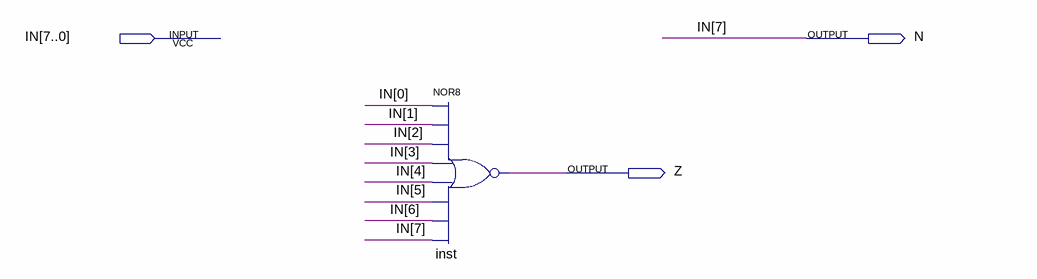
[diagram p0: schematic sheet]
// Quartus schematic flagLogic.bdf as structural Verilog: 1 symbols, 3 pins
module flagLogic (
  input  [7:0] IN,
  output N,
  output Z
);

  nor inst (Z, IN[0], IN[1], IN[2], IN[3], IN[4], IN[5], IN[6], IN[7]);

  assign N = IN[7];
endmodule
